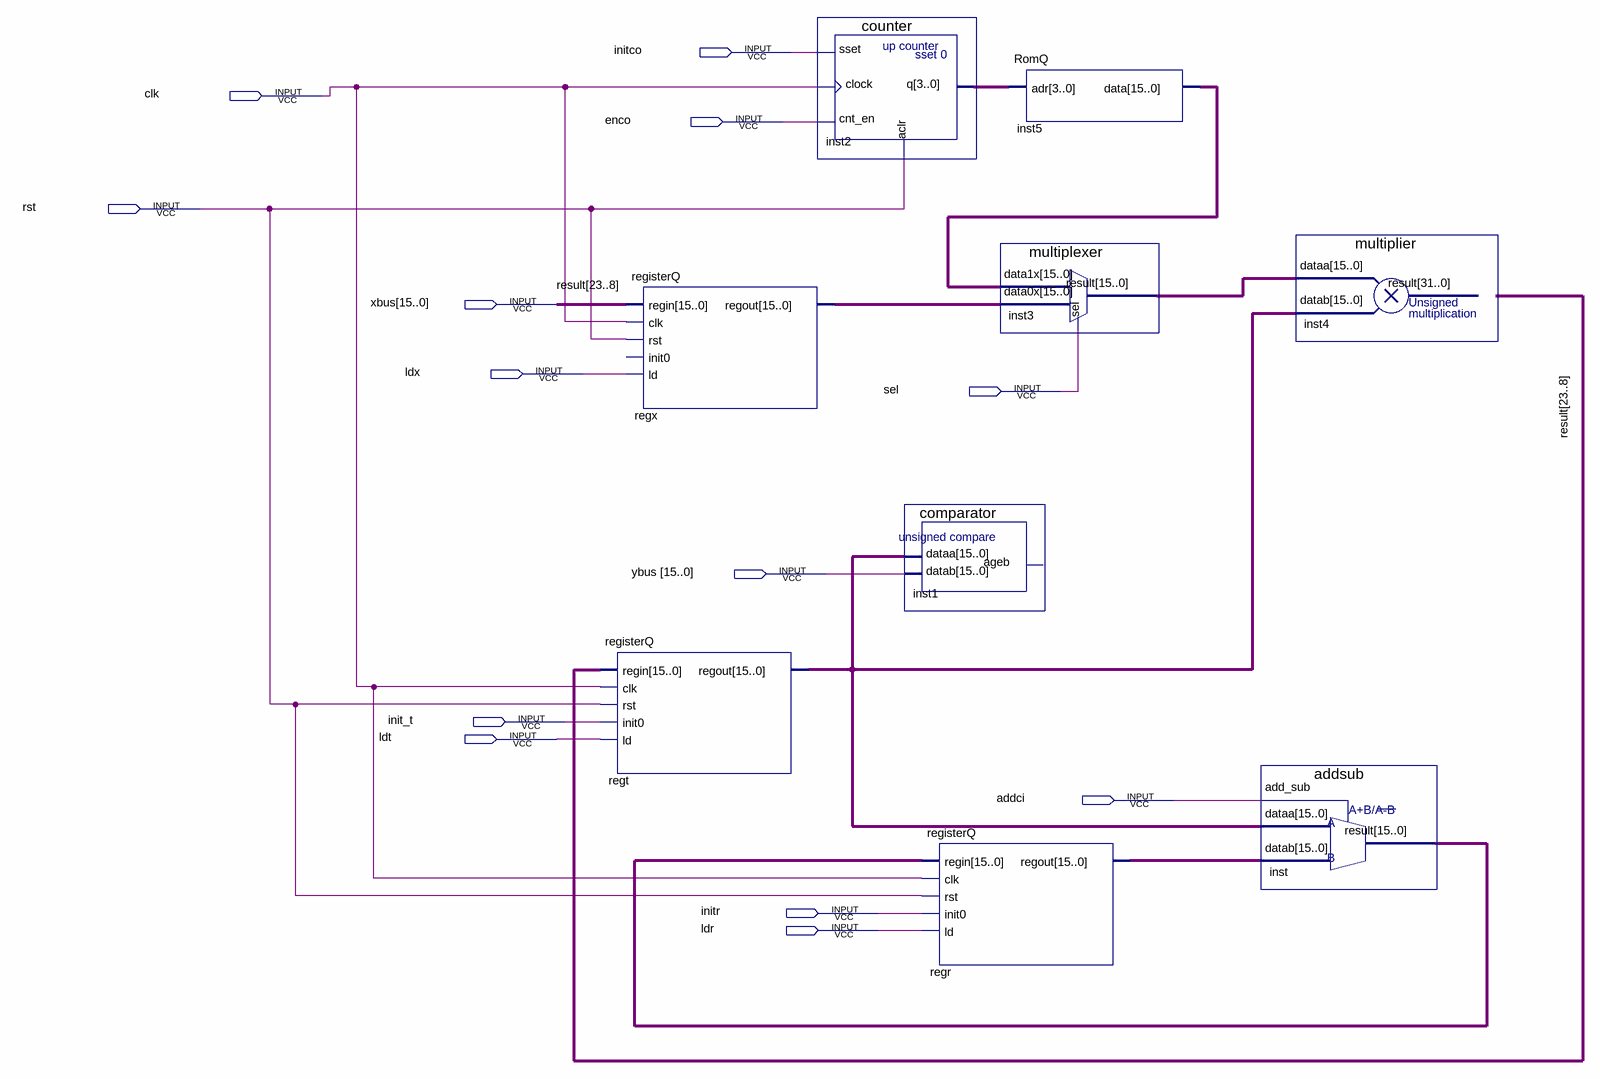
[diagram p0: schematic sheet]
// Quartus schematic datapathblock.bdf as structural Verilog: 9 symbols, 13 pins
module datapathblock (
  input  initco,
  input  clk,
  input  enco,
  input  rst,
  input  [15:0] xbus,
  input  ldx,
  input  sel,
  input  [15:0] ybus,
  input  init_t,
  input  ldt,
  input  addci,
  input  initr,
  input  ldr
);

  wire [3:0] inst2_q;
  wire [15:0] inst3_result, inst5_data, inst_result, regr_regout, regt_regout, regx_regout;

  registerQ regx (.regin(xbus), .clk(clk), .rst(rst), .ld(ldx), .regout(regx_regout));  // open: init0
  registerQ regt (.regin(xbus), .clk(clk), .rst(rst), .init0(init_t), .ld(ldt), .regout(regt_regout));
  counter inst2 (.sset(initco), .clock(clk), .cnt_en(enco), .aclr(rst), .q(inst2_q));
  comparator inst1 (.dataa(regt_regout), .datab(ybus));  // open: ageb
  registerQ regr (.regin(inst_result), .clk(clk), .rst(rst), .init0(initr), .ld(ldr), .regout(regr_regout));
  RomQ inst5 (.adr(inst2_q), .data(inst5_data));
  multiplexer inst3 (.data1x(inst5_data), .data0x(regx_regout), .sel(sel), .result(inst3_result));
  addsub inst (.add_sub(addci), .dataa(regt_regout), .datab(regr_regout), .result(inst_result));
  multiplier inst4 (.dataa(inst3_result), .datab(regt_regout), .result(xbus));

  // Other names for the same wires on the sheet: result[23:8] = xbus
endmodule
